# Altium schematic sheet Schaltbox-Renault_Switch.SchDoc: Schaltbox für PC I/O - Switches
size A3; Organization: Schleißheimer GmbH; Address2: Am Kalkofen 10; Address3: D-61206 Wöllstadt; Address4: Deutschland; Revision: 1.0; SheetNumber: 2; SheetTotal: 2; PageSetup: Record=PageOptions|CenterHorizontal=True|CenterVertical=True|PrintScale=0.70|XCorrection=1.00|YCorrection=1.00|PrintKind=0|BorderSize=5000000|LeftOffset=0|BottomOffset=0|Orientation=2|PaperLength=1000|PaperWidth=1000|Scale=100|PaperSource=7|PrintQuality=-4|MediaType=1|DitherType=10|PrintScaleMode=1|PaperKind=A4|PaperIndex=9; ProjectName: Remote AP
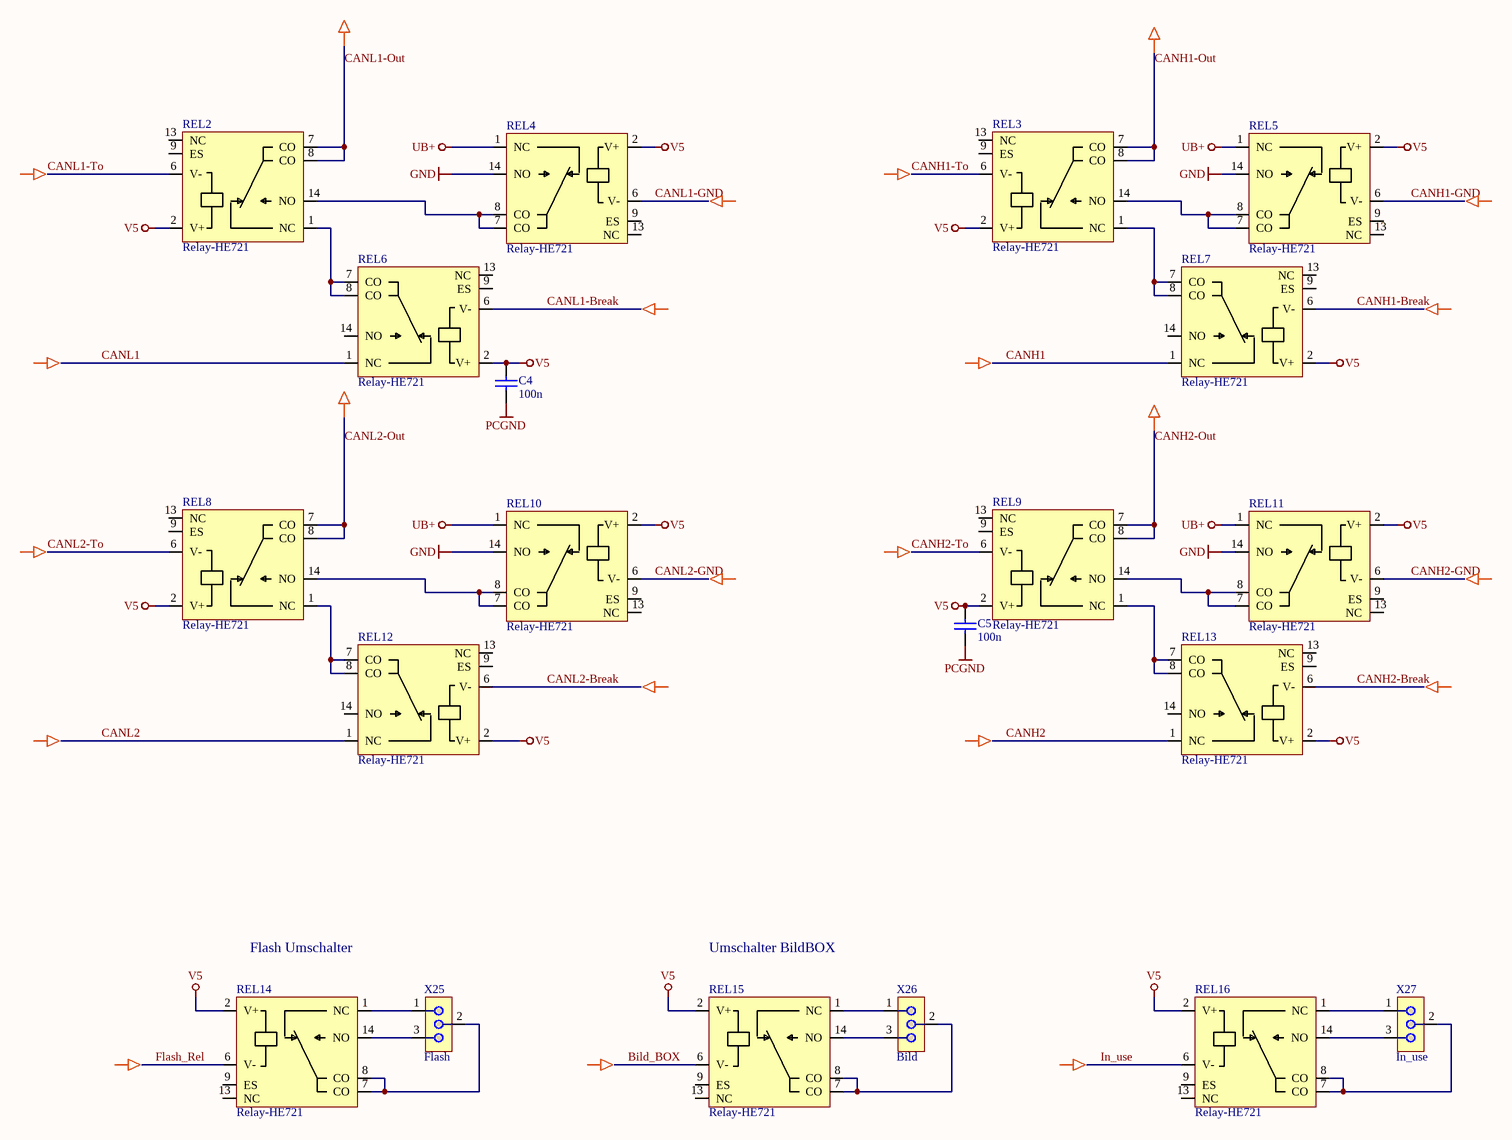
[diagram p0: Schaltbox-Renault_Switch.SchDoc]

## Parts
(Parts that share a designator on the sheet are numbered #1, #2 ... from top to bottom, then left to right.)
*#1  Pfeil-->  (value not drawn)  (graphical)
*#2  Pfeil-->  (value not drawn)  (graphical)
*#3  Pfeil-->  (value not drawn)  (graphical)
*#4  Pfeil-->  (value not drawn)  (graphical)
*#5  Pfeil-->  (value not drawn)  (graphical)
*#6  Pfeil-->  (value not drawn)  (graphical)
*#7  Pfeil-->  (value not drawn)  (graphical)
*#8  Pfeil-->  (value not drawn)  (graphical)
*#9  Pfeil-->  (value not drawn)  (graphical)
*#10  Pfeil-->  (value not drawn)  (graphical)
*#11  Pfeil-->  (value not drawn)  (graphical)
*#12  Pfeil-->  (value not drawn)  (graphical)
*#13  Pfeil-->  (value not drawn)  (graphical)
*#14  Pfeil-->  (value not drawn)  (graphical)
*#15  Pfeil-->  (value not drawn)  (graphical)
*#16  Pfeil-->  (value not drawn)  (graphical)
*#17  Pfeil-->  (value not drawn)  (graphical)
*#18  Pfeil-->  (value not drawn)  (graphical)
*#19  Pfeil-->  (value not drawn)  (graphical)
*#20  Pfeil-->  (value not drawn)  (graphical)
*#21  Pfeil-->  (value not drawn)  (graphical)
*#22  Pfeil-->  (value not drawn)  (graphical)
*#23  Pfeil-->  (value not drawn)  (graphical)
C4  100n  [C0603MD]
C5  100n  [C0603MD]
REL2  Relay-HE721  [DIP14 - HE700]
REL3  Relay-HE721  [DIP14 - HE700]
REL4  Relay-HE721  [DIP14 - HE700]
REL5  Relay-HE721  [DIP14 - HE700]
REL6  Relay-HE721  [DIP14 - HE700]
REL7  Relay-HE721  [DIP14 - HE700]
REL8  Relay-HE721  [DIP14 - HE700]
REL9  Relay-HE721  [DIP14 - HE700]
REL10  Relay-HE721  [DIP14 - HE700]
REL11  Relay-HE721  [DIP14 - HE700]
REL12  Relay-HE721  [DIP14 - HE700]
REL13  Relay-HE721  [DIP14 - HE700]
REL14  Relay-HE721  [DIP14 - HE700]
REL15  Relay-HE721  [DIP14 - HE700]
REL16  Relay-HE721  [DIP14 - HE700]
X25  Flash  [Stifte_1x3]
X26  Bild  [Stifte_1x3]
X27  In_use  [Stifte_1x3]

## Nets
GND: REL4.14(NO) REL5.14(NO) REL10.14(NO) REL11.14(NO)
PCGND: C4.1 C5.1
UB+: REL4.1(NC) REL5.1(NC) REL10.1(NC) REL11.1(NC)
V5: C4.2 C5.2 REL2.2(V+) REL3.2(V+) REL4.2(V+) REL5.2(V+) REL6.2(V+) REL7.2(V+) REL8.2(V+) REL9.2(V+) REL10.2(V+) REL11.2(V+) REL12.2(V+) REL13.2(V+) REL14.2(V+) REL15.2(V+) REL16.2(V+)
Bild_BOX: REL15.6(V-)
CANH1: REL7.1(NC)
CANH1-Break: REL7.6(V-)
CANH1-GND: REL5.6(V-)
CANH1-Out: REL3.7(CO) REL3.8(CO)
CANH1-To: REL3.6(V-)
CANH2: REL13.1(NC)
CANH2-Break: REL13.6(V-)
CANH2-GND: REL11.6(V-)
CANH2-Out: REL9.7(CO) REL9.8(CO)
CANH2-To: REL9.6(V-)
CANL1: REL6.1(NC)
CANL1-Break: REL6.6(V-)
CANL1-GND: REL4.6(V-)
CANL1-Out: REL2.7(CO) REL2.8(CO)
CANL1-To: REL2.6(V-)
CANL2: REL12.1(NC)
CANL2-Break: REL12.6(V-)
CANL2-GND: REL10.6(V-)
CANL2-Out: REL8.7(CO) REL8.8(CO)
CANL2-To: REL8.6(V-)
Flash_Rel: REL14.6(V-)
In_use: REL16.6(V-)
NetREL2_1: REL2.1(NC) REL6.7(CO) REL6.8(CO)
NetREL2_14: REL2.14(NO) REL4.7(CO) REL4.8(CO)
NetREL3_1: REL3.1(NC) REL7.7(CO) REL7.8(CO)
NetREL3_14: REL3.14(NO) REL5.7(CO) REL5.8(CO)
NetREL8_1: REL8.1(NC) REL12.7(CO) REL12.8(CO)
NetREL8_14: REL8.14(NO) REL10.7(CO) REL10.8(CO)
NetREL9_1: REL9.1(NC) REL13.7(CO) REL13.8(CO)
NetREL9_14: REL9.14(NO) REL11.7(CO) REL11.8(CO)
NetREL14_1: REL14.1(NC) X25.1
NetREL14_7: REL14.7(CO) REL14.8(CO) X25.2
NetREL14_14: REL14.14(NO) X25.3
NetREL15_1: REL15.1(NC) X26.1
NetREL15_7: REL15.7(CO) REL15.8(CO) X26.2
NetREL15_14: REL15.14(NO) X26.3
NetREL16_1: REL16.1(NC) X27.1
NetREL16_7: REL16.7(CO) REL16.8(CO) X27.2
NetREL16_14: REL16.14(NO) X27.3

Not connected (* = marked no-connect by the designer): REL2 9(ES) 13(NC); REL3 9(ES) 13(NC); REL4 9(ES) 13(NC); REL5 9(ES) 13(NC); REL6 9(ES) 13(NC) 14(NO); REL7 9(ES) 13(NC) 14(NO); REL8 9(ES) 13(NC); REL9 9(ES) 13(NC); REL10 9(ES) 13(NC); REL11 9(ES) 13(NC); REL12 9(ES) 13(NC) 14(NO); REL13 9(ES) 13(NC) 14(NO); REL14 9(ES) 13(NC); REL15 9(ES) 13(NC); REL16 9(ES) 13(NC)

## Notes on the sheet
- Flash Umschalter
- Umschalter BildBOX
- Title
- Size:
- Date:
- A3
- Number:
- Time:
- Revision:
- Sheet
- of
- File:

## Library data of the parts
*#1-*#23 = Pfeil-->: No Footprint
C4 C5 = Cap: Capacitor; Value: 100p; Published: 8-Jun-2000; LatestRevisionDate: 17-Jul-2002; LatestRevisionNote: Re-released for DXP Platform.; PackageReference: RAD-0.3; Publisher: Altium Limited
REL2-REL16 = Relay-HE721: Hamlin Reed-Relay SPDT
X25-X27 = Jumper-3: 3pol Jumper RM 2.54